# Altium schematic sheet Oscilator.SchDoc
size A4; SheetNumber: 11; SheetTotal: 13
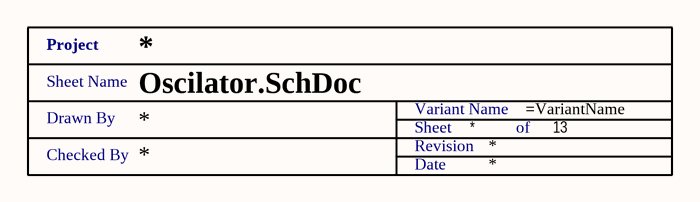
[diagram p0: Oscilator.SchDoc]

## Parts
XX?  Title 1  (value not drawn)  (graphical)

## Notes on the sheet
- (in symbol Title 1) Project; Sheet Name; Variant Name; Drawn By; Sheet; of; Revision; Checked By; Date